# EAGLE design Adafruit STMPE610 (EAGLE 6.3)
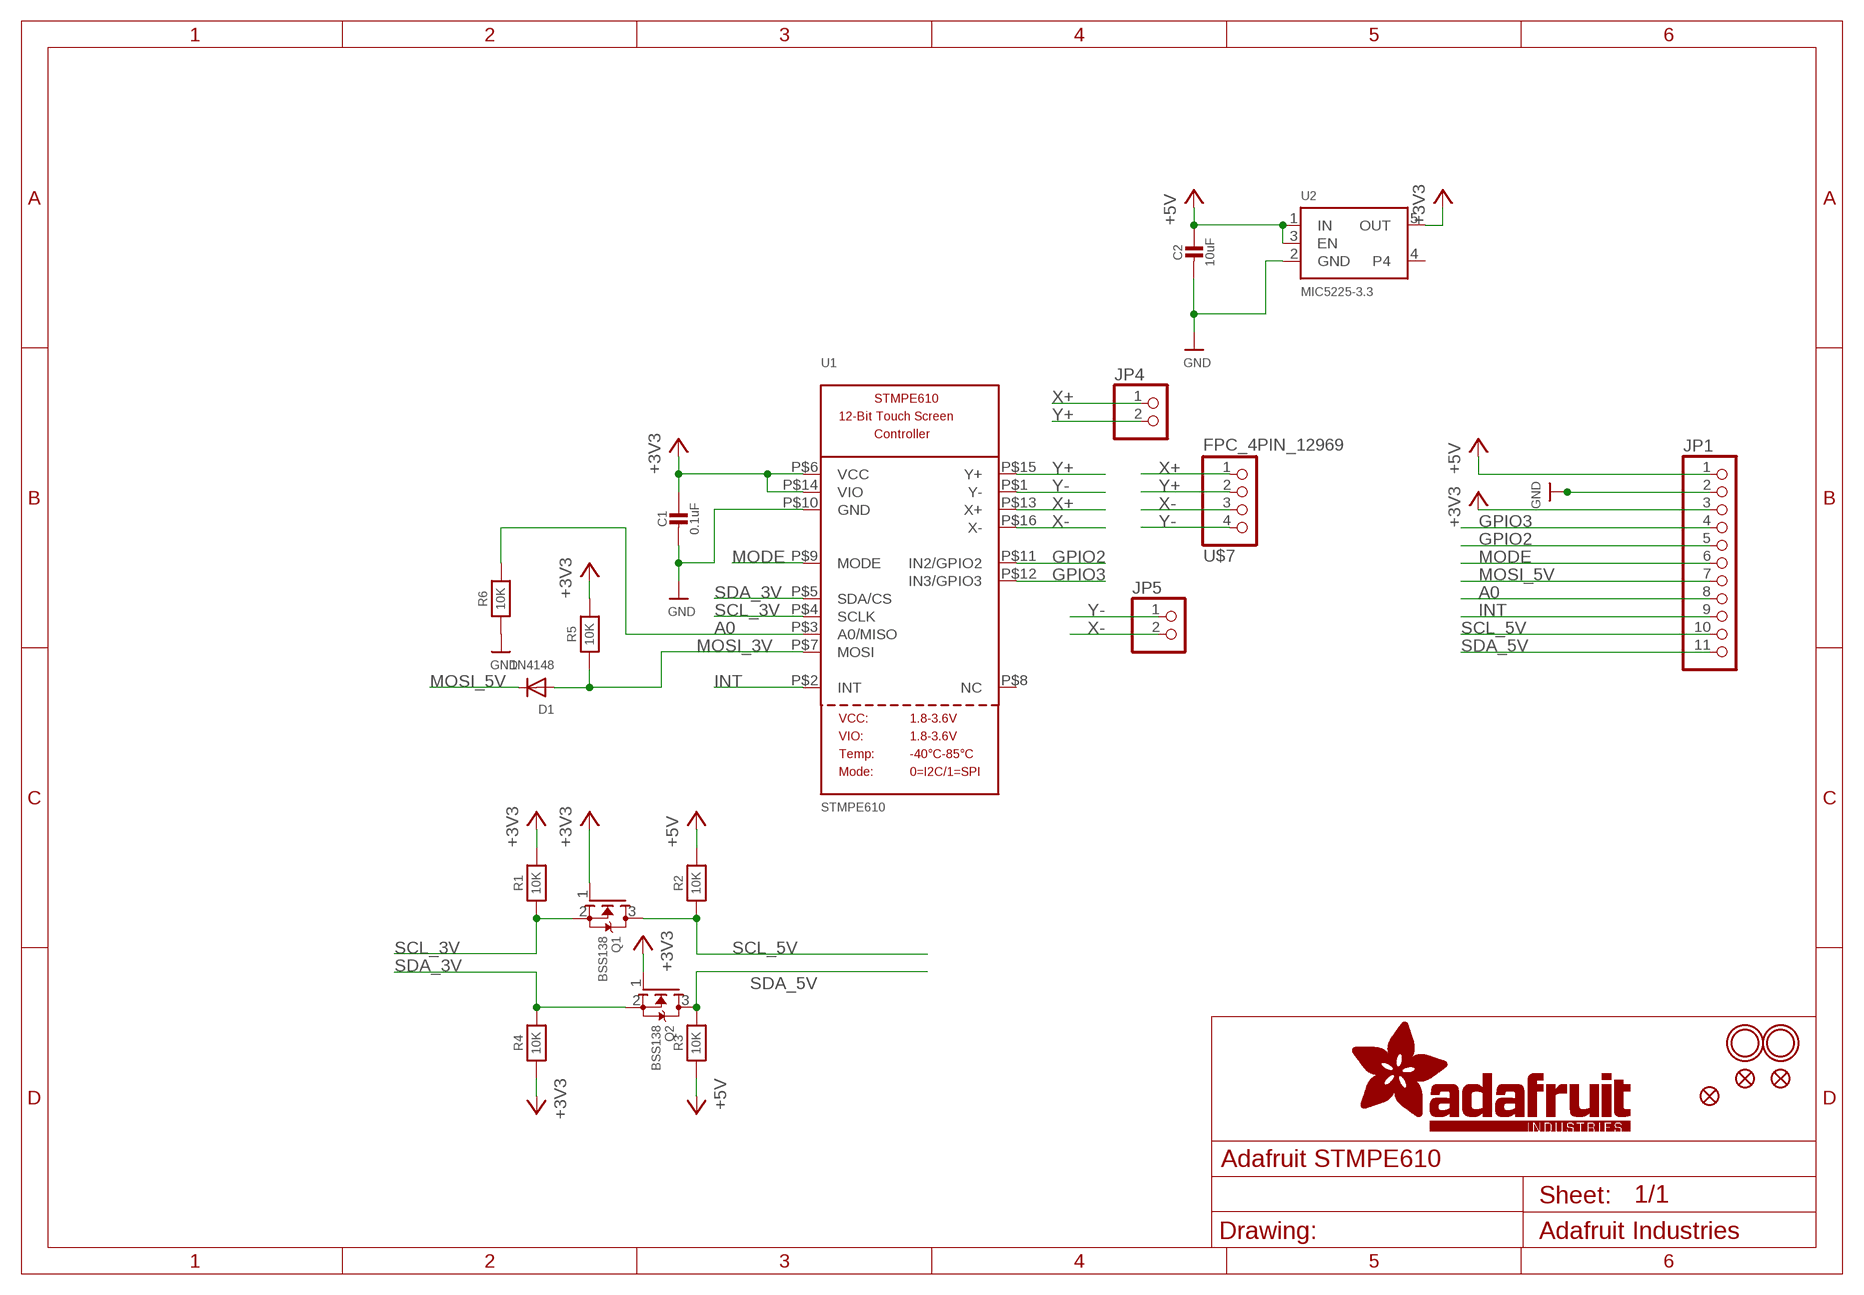
[diagram p0: schematic, sheet 1]

## Parts
C1  0.1uF  CAP_CERAMIC0805-NOOUTLINE  [0805-NO]
C2  10uF  CAP_CERAMIC0805-NOOUTLINE  [0805-NO]
D1  1N4148  DIODESOD-323F  [SOD-323F]
FID1  FIDUCIAL""  [FIDUCIAL_1MM]
FID2  FIDUCIAL""  [FIDUCIAL_1MM]
FID3  FIDUCIAL""  [FIDUCIAL_1MM]
JP1  HEADER-1X11  [1X11_ROUND]
JP4  HEADER-1X2ROUND  [1X02_ROUND]
JP5  HEADER-1X2ROUND  [1X02_ROUND]
Q1  BSS138  MOSFET-NREFLOW  [SOT23]
Q2  BSS138  MOSFET-NREFLOW  [SOT23]
R1  10K  RESISTOR0805_NOOUTLINE  [0805-NO]
R2  10K  RESISTOR0805_NOOUTLINE  [0805-NO]
R3  10K  RESISTOR0805_NOOUTLINE  [0805-NO]
R4  10K  RESISTOR0805_NOOUTLINE  [0805-NO]
R5  10K  RESISTOR0805_NOOUTLINE  [0805-NO]
R6  10K  RESISTOR0805_NOOUTLINE  [0805-NO]
U1  STMPE610  [QFN16_3MM]
U2  MIC5225-3.3  VREG_SOT23-5  [SOT23-5]
U$4  MOUNTINGHOLE2.5  [MOUNTINGHOLE_2.5_PLATED]
U$5  MOUNTINGHOLE2.5  [MOUNTINGHOLE_2.5_PLATED]
U$7  FPC_4PIN_12969  [FPC_CONN_1MM_DUAL_4P]

## Nets
+3V3: C1.1 JP1.3 Q1.1(G) Q2.1(G) R1.2 R4.1 R5.2 U1.P$6(VCC) U1.P$14(VIO) U2.5(OUT)
+5V: C2.1 JP1.1 R2.2 R3.1 U2.1(IN) U2.3(EN)
A0: JP1.8 R6.2 U1.P$3(A0/MISO)
GND: C1.2 C2.2 JP1.2 R6.1 U1.P$10(GND) U2.2(GND)
GPIO2: JP1.5 U1.P$11(IN2/GPIO2)
GPIO3: JP1.4 U1.P$12(IN3/GPIO3)
INT: JP1.9 U1.P$2(INT)
MODE: JP1.6 U1.P$9(MODE)
MOSI_3V: D1.A R5.1 U1.P$7(MOSI)
MOSI_5V: D1.C JP1.7
SCL_3V: Q1.2(S) R1.1 U1.P$4(SCLK)
SCL_5V: JP1.10 Q1.3(D) R2.1
SDA_3V: Q2.2(S) R4.2 U1.P$5(SDA/CS)
SDA_5V: JP1.11 Q2.3(D) R3.2
X+: JP4.1 U1.P$13(X+) U$7.1
X-: JP5.2 U1.P$16(X-) U$7.3
Y+: JP4.2 U1.P$15(Y+) U$7.2
Y-: JP5.1 U1.P$1(Y-) U$7.4
Unconnected: U1.P$8(NC) U2.4

## Library data of the parts
C1 C2 = microbuilder:CAP_CERAMIC: Ceramic Capacitors For new designs, use the packages preceded by an '_' character since they are more reliable: The following footprints should be used on most boards: _0402 - Standard footprint for regular board layouts _0603 - Standard footprint for regular board layouts _0805 - Standard footprint for regular board layouts _1206 - Standard footprint for regular board layouts For extremely tight-pitch boards where space is at a premium, the following 'micro-pitch' footprints can be used (smaller pads, no silkscreen outline, etc.): _0402MP - Micro-pitch footprint for very dense/compact boards _0603MP - Micro-pitch footprint for very dense/compact boards _0805MP - Micro-pitch footprint for very dense/compact boards _1206MP - Micro-pitch footprint for very dense/compact boards
D1 = adafruit:DIODE: Diode SMADIODE - SMA Surface Mount Package 20V 1A Schottky Diode Digikey: 641-1014-6-ND DO-1N4148 - Through Hole Small Current Diode SOD-123 20V 1 A (.5mV Vf) Schottky Diode - Digikey: MBRX120TPMSCT-ND SOD-323 10V 570mA (.38mV Vf, 3ns) Schottky Diode - Digikey: ZLLS410CT-ND SOD-523 30V 30mA Schottky Diode (RB751S-40TE61) - Digikey: RB751S-40TE61CT-ND SOT23-R/W - SOT23 Package (R = Solder Paste/Reflow Ovens, W = Hand-Soldering) BAT54Film 40V 300mA - Digikey: 497-7162-1-ND
FID1-FID3 = microbuilder:FIDUCIAL: Fiducial Alignment Points Various fiducial points for machine vision alignment.; BOM: EXCLUDE
JP1 = microbuilder:HEADER-1X11
JP4 JP5 = microbuilder:HEADER-1X2: PIN HEADER
Q1 Q2 = adafruit:MOSFET-N: N-Channel Mosfet 2N7002E - 60V 260mA SOT23 [Digikey: 2N7002ET1GOSTR-ND] - REEL BSH103 - 30V 850mA SOT23 [Digikey: 568-5013-1-ND]
R1-R6 = microbuilder:RESISTOR: Resistors For new designs, use the packages preceded by an '_' character since they are more reliable: The following footprints should be used on most boards: _0402 - Standard footprint for regular board layouts _0603 - Standard footprint for regular board layouts _0805 - Standard footprint for regular board layouts _1206 - Standard footprint for regular board layouts For extremely tight-pitch boards where space is at a premium, the following 'micro-pitch' footprints can be used (smaller pads, no silkscreen outline, etc.): _0402MP - Micro-pitch footprint for very dense/compact boards _0603MP - Micro-pitch footprint for very dense/compact boards _0805MP - Micro-pitch footprint for very dense/compact boards _1206MP - Micro-pitch footprint for very dense/compact boards
U1 = microbuilder:STMPE610: STMPE610 - 12-Bit Touch Screen Controller
U2 = microbuilder:VREG_SOT23-5: SOT23-5 Fixed Voltage Regulators Part Current Out V Out V In V Dropout θJA (°C/W) TJ (°C) Digikey Part No. ADP121 150mA 3.3V 3.4-5.5V 0.09V @ 150mA -- -- ADP121-AUJZ33R7CT-ND ADP121 150mA 3.0V 3.1-5.5V 0.09V @ 150mA -- -- ADP121-AUJZ30R7CT-ND ADP122 300mA 3.3V 3.4-5.5V 0.085V @ 300mA -- -- ADP122AUJZ-3.3-R7CT-ND ADP1712 300mA 3.3V 3.5-5.5V 0.17V @ 300mA -- -- ADP1712AUJZ-3.3-R7TR-ND AP7311 (Low Cost) 150mA 3.3V 3.5-6V 0.15V @ 150mA -- -- AP7311-33WG-7DICT-ND LD39015M18R 150mA 1.8V 1.9V-5.5V 0.08V @ 100mA -- -- 497-6977-1-ND LP2985A-33DBVR 150mA 3.3V 3.3-16V 0.28V @ 150mA 206 150 296-18479-1-ND MCP1824T-3302E/OT 300mA 3.3V 3.5V-6V 0.2V @ 300mA -- -- MCP1824T-3302E/OTCT-ND MIC5205-2.5YM5 TR 150mA 2.5V 2.7-16V 0.165V @ 150mA -- -- 576-1257-2-ND MIC5205-3.0YM5 TR 150mA 3.0V 3.2V-16V 0.165V @ 150mA -- -- 576-1258-2-ND MIC5205-3.3YM5 TR 150mA 3.3V 3.5V-16V 0.165V @ 150mA -- -- 576-1259-2-ND TPS780330220 150mA 3.3V+2.2V 3.6-5.5V 250mV Max -- -- 296-23332-1-ND TDA3663/N1,135 100mA 3.3V 3.5-45V 0.18V @ 50mA -- -- 568-5343-1-ND Max operating temp can be calculated using θJA, TJ (max junction temperature), and power in watts. Set the "Maximum Ambient Temperature" until it reaches TJ ("Max Junction Temperature"), which is the absolute limit for safe use of the regulator: Heat Sink Temperature Calculator <http://www.daycounter.com/Calculators/Heat-Sink-Temperature-Calculator.phtml> For example, With 12V source into a 3.3V LP2985 and a 30mA load, we are dissipating (12V-3.3V) * 0.03A = 0.261W. With a θJA of 206 °C/W, a TJ of 150°C, and 261mW we can safely use the chip without a heat sink up to 75°C (=147.1°C Junction Temperature).
U$4 U$5 = microbuilder:MOUNTINGHOLE: Mounting Hole For #2 screws (0.086"/2.18mm width, 0.094"/2.4mm hole) use 2.5mm; BOM: EXCLUDE
U$7 = microbuilder:FPC_4PIN

## Board
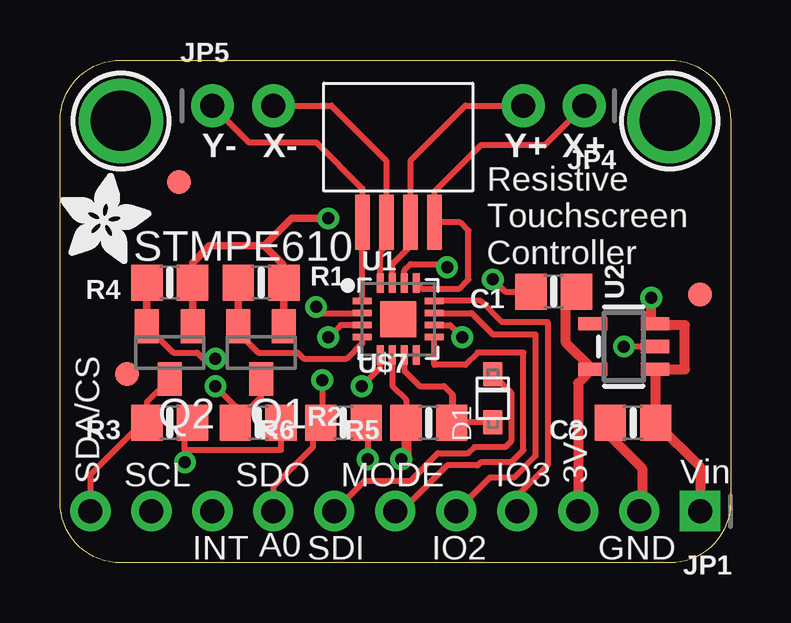
[diagram p1: board, top side]
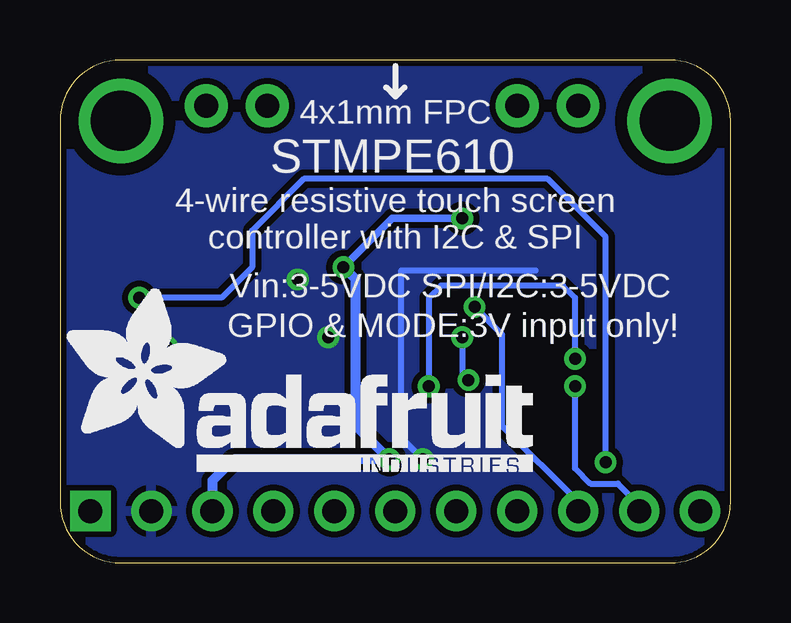
[diagram p2: board, bottom side, seen from below]

Size 27.94 x 20.95 mm. Coordinates in mm from the lower left corner, seen from the top.
Outline: 27.94,18.41 27.94,2.54 arc-90 25.4,0 2.54,0 arc-90 0,2.54 0,18.41 arc-90 2.54,20.95 25.4,20.95 arc-90 27.94,18.41
Copper layers (1*16): Top 0.035mm / dielectric 1.5mm / Bottom 0.035mm
Design rules "adafruit *": minimum track width 8mil, minimum drill 15.5mil, track to track 8mil, track to pad 8mil, pad to pad 8mil, via to via 8mil, smd to smd 8mil, copper to edge 10mil, drill to drill 8mil, minimum pad ring 10mil, minimum via ring 8mil, stop-mask expansion 4mil, vias tented up to drill 20mil, thermal gap 10mil

### Footprints (pad centres in the part's own frame; a part is rotated, then mirrored left to right if it is on the bottom)
0805-NO = smd 1.3 x 1.5: 1 -0.95,0; 2 0.95,0
SOD-323F = smd 1 x 0.8: A -1,0; C 1,0
FIDUCIAL_1MM = smd 1 x 1: 1 0,0
1X11_ROUND = drill 1 pad 1.676 square: 1 -12.7,0 | drill 1 pad 1.676: 2 -10.16,0; 3 -7.62,0; 4 -5.08,0; 5 -2.54,0; 6 0,0; 7 2.54,0; 8 5.08,0; 9 7.62,0; 10 10.16,0; 11 12.7,0
1X02_ROUND = drill 1 pad 1.778: 1 -1.27,0; 2 1.27,0
SOT23 = smd 1 x 1.4: 1 -0.95,-1.1; 2 0.95,-1.1; 3 0,1.1
QFN16_3MM = smd 0.8 x 0.28: P$1 -1.5,0.75; P$2 -1.5,0.25; P$3 -1.5,-0.25; P$4 -1.5,-0.75; P$9 1.5,-0.75; P$10 1.5,-0.25; P$11 1.5,0.25; P$12 1.5,0.75 | smd 0.28 x 0.8: P$5 -0.75,-1.5; P$6 -0.25,-1.5; P$7 0.25,-1.5; P$8 0.75,-1.5; P$13 0.75,1.5; P$14 0.25,1.5; P$15 -0.25,1.5; P$16 -0.75,1.5 | smd 1.5 x 1.5: THERMAL 0,0
SOT23-5 = smd 0.55 x 1.2: 1 -0.95,-1.3; 2 0,-1.3; 3 0.95,-1.3; 4 0.95,1.3; 5 -0.95,1.3
MOUNTINGHOLE_2.5_PLATED = drill 2.5 pad 3.2: P$1 0,0
FPC_CONN_1MM_DUAL_4P = smd 0.6 x 2.3: 1 -1.5,1.3; 2 -0.5,1.3; 3 0.5,1.3; 4 1.5,1.3

### Placement (x,y rotation side)
C1  20.57,11.3 180 top
C2  23.88,5.84 180 top
D1  18.03,6.86 90 top
FID1  4.95,15.88 0 top
FID2  26.67,11.18 0 top
FID3  2.79,7.87 0 top
JP1  13.97,2.16 180 top
JP4  20.57,19.05 180 top
JP5  7.62,19.05 0 top
Q1  8.38,8.76 180 top
Q2  4.57,8.76 180 top
R1  8.38,11.68 0 top
R2  8.26,5.84 0 top
R3  4.57,5.84 180 top
R4  4.57,11.68 180 top
R5  15.37,5.84 180 top
R6  11.81,5.84 180 top
U1  14.1,10.16 0 top
U2  23.5,9.02 90 top
U$4  2.54,18.41 0 top
U$5  25.4,18.41 0 top
U$6  [ADAFRUIT_TEXT_20MM]  27.81,3.81 0 bottom
U$7  14.1,15.49 180 top
U$8  [ADAFRUIT_3.5MM]  0,12.45 0 top

### Tracks (layer width: path | path; a pad name or v marks a point on that pad's centre or on a via)
+3V3  (via drill 0.5)
  Top 0.254: U1.P$6 13.85,7.36 14.42,6.79 R5.2 | U1.P$14 14.35,12.19 14.61,12.45 16,12.45 v16.13,12.32 | 22.16,8.07 U2.5 | 21.08,10.92 21.46,11.3 C1.1
  Top 0.305: Q2.1 R4.1 5.52,12.51 6.22,13.21 8.51,13.21 | Q1.1 R1.2 9.27,11.74 9.27,12.45 8.51,13.21 | 8.51,13.21 9.65,14.35 v11.18,14.35
  Top 0.406: U2.5 21.08,9.18 21.08,10.92 | R5.2 14.42,4.51 v14.22,4.32 | 22.16,8.07 21.59,7.49 JP1.3
  Bottom 0.305: v11.18,14.35 14.1,14.35 v16.13,12.32
  Bottom 0.406: v16.13,12.32 15.62,11.81 15.62,5.71 v14.22,4.32 20.7,4.32 21.59,3.43 JP1.3
+5V  (via drill 0.5)
  Top 0.254: R2.2 9.21,4.7 5.21,4.7 | 5.21,4.7 5.21,5.84 R3.1 | 24.83,8.04 U2.1 | 5.21,4.7 v5.21,4.19
  Top 0.406: 24.83,8.04 C2.1 26.67,4 JP1.1 | U2.1 26.04,8.07 26.04,9.91 24.8,9.91 U2.3 24.64,9.97 v24.64,11.05
  Bottom 0.254: v5.21,4.19 5.21,13.59 7.62,16 17.78,16 19.94,13.84 19.94,12.32 21.21,11.05 v24.64,11.05
A0  (via drill 0.5)
  Top 0.254: U1.P$3 11.69,9.91 v11.18,9.4 | JP1.8 8.89,3.17 10.54,4.83 10.54,5.52 R6.2 10.92,5.9 v10.92,7.62
  Bottom 0.254: v11.18,9.4 11.18,7.87 v10.92,7.62
GND  (via drill 0.5)
  Top 0.254: U2.2 v23.5,9.02 | R6.1 12.83,5.91 v12.83,4.32 | U1.P$10 16.25,9.91 v16.76,9.4 | v18.03,11.81 18.54,11.3 C1.2
  Top 0.406: C2.2 22.93,5.27 24.26,3.94 24.26,2.16 JP1.2
  Bottom 0.254: v16.76,9.4 16.89,9.4 16.89,9.53 | v12.83,4.32 13.72,5.21 13.72,12.19 8.13,12.19
  pour Bottom (isolate 0.254): 0,0 0,21.21 27.94,21.21 27.94,0
GPIO2
  Top 0.254: U1.P$11 17.15,10.41 18.03,9.53 19.81,9.53 19.81,4.45 18.92,3.56 17.91,3.56 JP1.5
GPIO3
  Top 0.254: U1.P$12 15.61,10.92 17.53,10.92 18.41,10.03 20.32,10.03 20.32,4.06 19.05,2.79 JP1.4
INT  (via drill 0.5)
  Top 0.254: v10.67,10.67 10.93,10.41 U1.P$2
  Bottom 0.254: v10.67,10.67 9.53,9.53 9.53,5.71 6.35,2.54 JP1.9
MODE
  Top 0.254: U1.P$9 15.6,8.26 16.89,8.26 17.4,8.76 19.3,8.76 19.3,4.7 18.8,4.19 17.53,4.19 17.4,4.06 16.13,4.06 14.22,2.16 JP1.6
MOSI_3V
  Top 0.254: U1.P$7 14.35,8.01 14.99,7.37 16,7.37 16.32,7.05 | 16.32,7.05 16.38,6.99 16.38,5.86 D1.A | 16.32,7.05 R5.1
MOSI_5V
  Top 0.254: D1.C 18.8,7.1 18.8,5.08 18.54,4.83 17.27,4.83 17.02,4.57 15.75,4.57 14.61,3.43 12.7,3.43 JP1.7
SCL_3V
  Top 0.254: Q1.2 7.43,9.59 8.26,8.76 9.91,8.76 10.16,8.51 11.94,8.51 12.6,9.17 U1.P$4
  Top 0.305: Q1.2 R1.1
SCL_5V  (via drill 0.5)
  Top 0.254: Q1.3 8.38,6.92 R2.1 7.3,6.54 v6.48,7.37
  Bottom 0.254: v6.48,7.37 6.48,3.94 5.84,3.3 4.7,3.3 3.81,2.41 JP1.10
SDA_3V  (via drill 0.5)
  Top 0.254: v12.57,7.37 13.35,8.14 U1.P$5 | 3.62,10.1 Q2.2 4.72,8.76 5.71,8.76 5.97,8.51 v6.48,8.51
  Top 0.305: R4.2 3.62,10.1
  Bottom 0.254: v6.48,8.51 6.48,11.05 6.99,11.56 12.06,11.56 12.57,11.05 v12.57,7.37
SDA_5V
  Top 0.254: Q2.3 3.62,6.71 R3.2 3.43,5.84 1.27,3.68 JP1.11
X+
  Top 0.254: JP4.1 20.19,17.4 17.53,17.4 15.6,15.47 U$7.1 16.67,14.19 17.02,13.84 17.02,11.81 16.64,11.43 15.08,11.43 U1.P$13
X-
  Top 0.254: U1.P$16 13.35,12.97 13.59,13.21 U$7.3 13.59,14.2 13.59,16.76 11.3,19.05 JP5.2
Y+
  Top 0.254: U1.P$15 13.85,12.45 14.61,13.21 U$7.2 14.6,16.76 16.89,19.05 JP4.2
Y-
  Top 0.254: U1.P$1 U$7.4 12.6,15.6 10.67,17.53 7.87,17.53 JP5.1

### Text on the board
tPlace: Y- | X- | Y+ | X+ | STMPE610 | Resistive / Touchscreen / Controller | SCL | SDO | MODE | IO3 | Vin | SDA/CS | 3Vo | INT | A0 | SDI | IO2 | GND
bPlace: 4x1mm FPC | STMPE610 | 4-wire resistive touch screen / controller with I2C & SPI | Vin:3-5VDC SPI/I2C:3-5VDC | GPIO & MODE:3V input only!